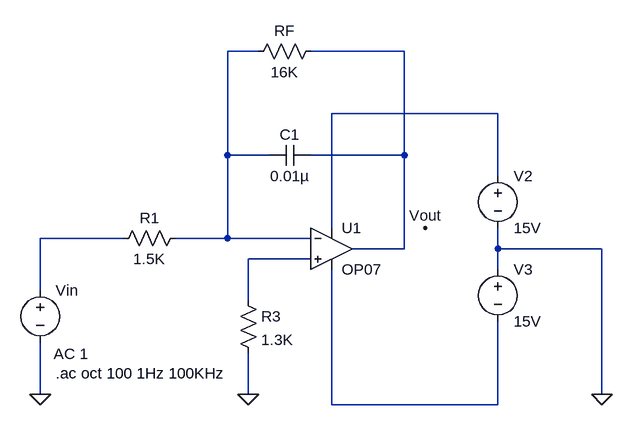
[diagram p0: schematic Exp 9.asc]
Exp 9.asc, the LTspice schematic file:
Version 4
SHEET 1 880 680
WIRE -16 -144 -64 -144
WIRE 208 -144 64 -144
WIRE 352 -48 96 -48
WIRE -64 16 -64 -144
WIRE 0 16 -64 16
WIRE 208 16 208 -144
WIRE 208 16 64 16
WIRE 352 48 352 -48
WIRE 96 128 96 -48
WIRE -224 144 -352 144
WIRE -64 144 -64 16
WIRE -64 144 -144 144
WIRE 64 144 -64 144
WIRE 208 160 208 16
WIRE 208 160 128 160
WIRE 352 160 352 128
WIRE 512 160 352 160
WIRE 64 176 -32 176
WIRE 352 192 352 160
WIRE -352 224 -352 144
WIRE -32 240 -32 176
WIRE -352 384 -352 304
WIRE -32 384 -32 320
WIRE 512 384 512 160
WIRE 96 400 96 192
WIRE 352 400 352 272
WIRE 352 400 96 400
FLAG -32 384 0
FLAG -352 384 0
FLAG 512 384 0
FLAG 240 128 Vout
SYMBOL voltage 352 32 R0
WINDOW 123 0 0 Left 0
WINDOW 39 0 0 Left 0
SYMATTR InstName V2
SYMATTR Value 15V
SYMBOL voltage 352 176 R0
WINDOW 123 0 0 Left 0
WINDOW 39 0 0 Left 0
SYMATTR InstName V3
SYMATTR Value 15V
SYMBOL res 80 -160 R90
WINDOW 0 0 56 VBottom 2
WINDOW 3 32 56 VTop 2
SYMATTR InstName RF
SYMATTR Value 16K
SYMBOL res -48 224 R0
SYMATTR InstName R3
SYMATTR Value 1.3K
SYMBOL res -128 128 R90
WINDOW 0 0 56 VBottom 2
WINDOW 3 32 56 VTop 2
SYMATTR InstName R1
SYMATTR Value 1.5K
SYMBOL voltage -352 208 R0
WINDOW 123 21 114 Left 2
WINDOW 39 0 0 Left 0
SYMATTR Value2 AC 1
SYMATTR InstName Vin
SYMATTR Value ""
SYMBOL OpAmps\\OP07 96 96 R0
SYMATTR InstName U1
SYMBOL cap 64 0 R90
WINDOW 0 0 32 VBottom 2
WINDOW 3 32 32 VTop 2
SYMATTR InstName C1
SYMATTR Value 0.01µ
TEXT -328 352 Left 2 !.ac oct 100 1Hz 100KHz

The netlist it stands for:
* Exp 9.asc
V2 N003 0 15V
V3 0 N006 15V
RF N002 N001 16K
R3 N005 0 1.3K
R1 N001 N004 1.5K
Vin N004 0 AC 1
XU1 N005 N001 N003 N006 N002 LT1001  ; OP07, pins In+ In- V+ V- OUT
C1 N002 N001 0.01µ
.ac oct 100 1Hz 100KHz
.lib LTC.lib
.backanno
.end